# Altium schematic sheet Command Generator.SchDoc
size A; Organization: Smart Product Design Lab; Address1: 201 Thornton; Address2: Stanford University; Address3: Stanford, CA; Address4: 94305-4021
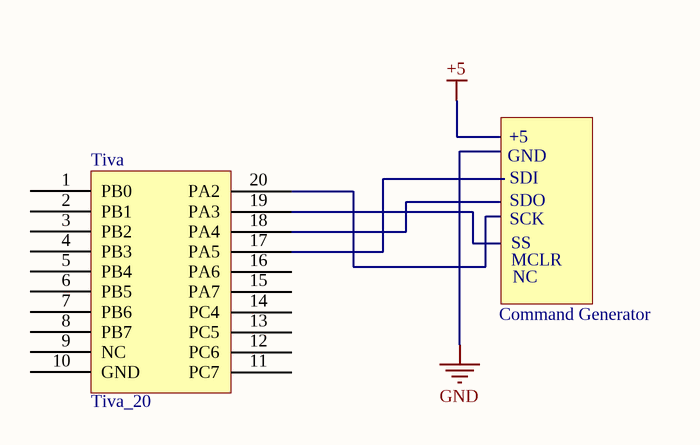
[diagram p0: Command Generator.SchDoc]

## Parts
Tiva  Tiva_20

## Nets

Not connected (* = marked no-connect by the designer): Tiva 1(PB0) 2(PB1) 3(PB2) 4(PB3) 5(PB4) 6(PB5) 7(PB6) 8(PB7) 9(NC) 10(GND) 11(PC7) 12(PC6) 13(PC5) 14(PC4) 15(PA7) 16(PA6) 17(PA5) 18(PA4) 19(PA3) 20(PA2)

## Notes on the sheet
- GND
- +5
- SDI
- SDO
- SCK
- MCLR
- SS
- NC
- Command Generator
- Title
- Size:
- Date:
- File:
- A
- Number:
- Time:
- Revision:
- Sheet
- of
- Drawn By:

## Library data of the parts
Tiva = Tiva_20: Tiva Protection 20 Pin Connector